# Altium project RA6M1_2.PrjPcb
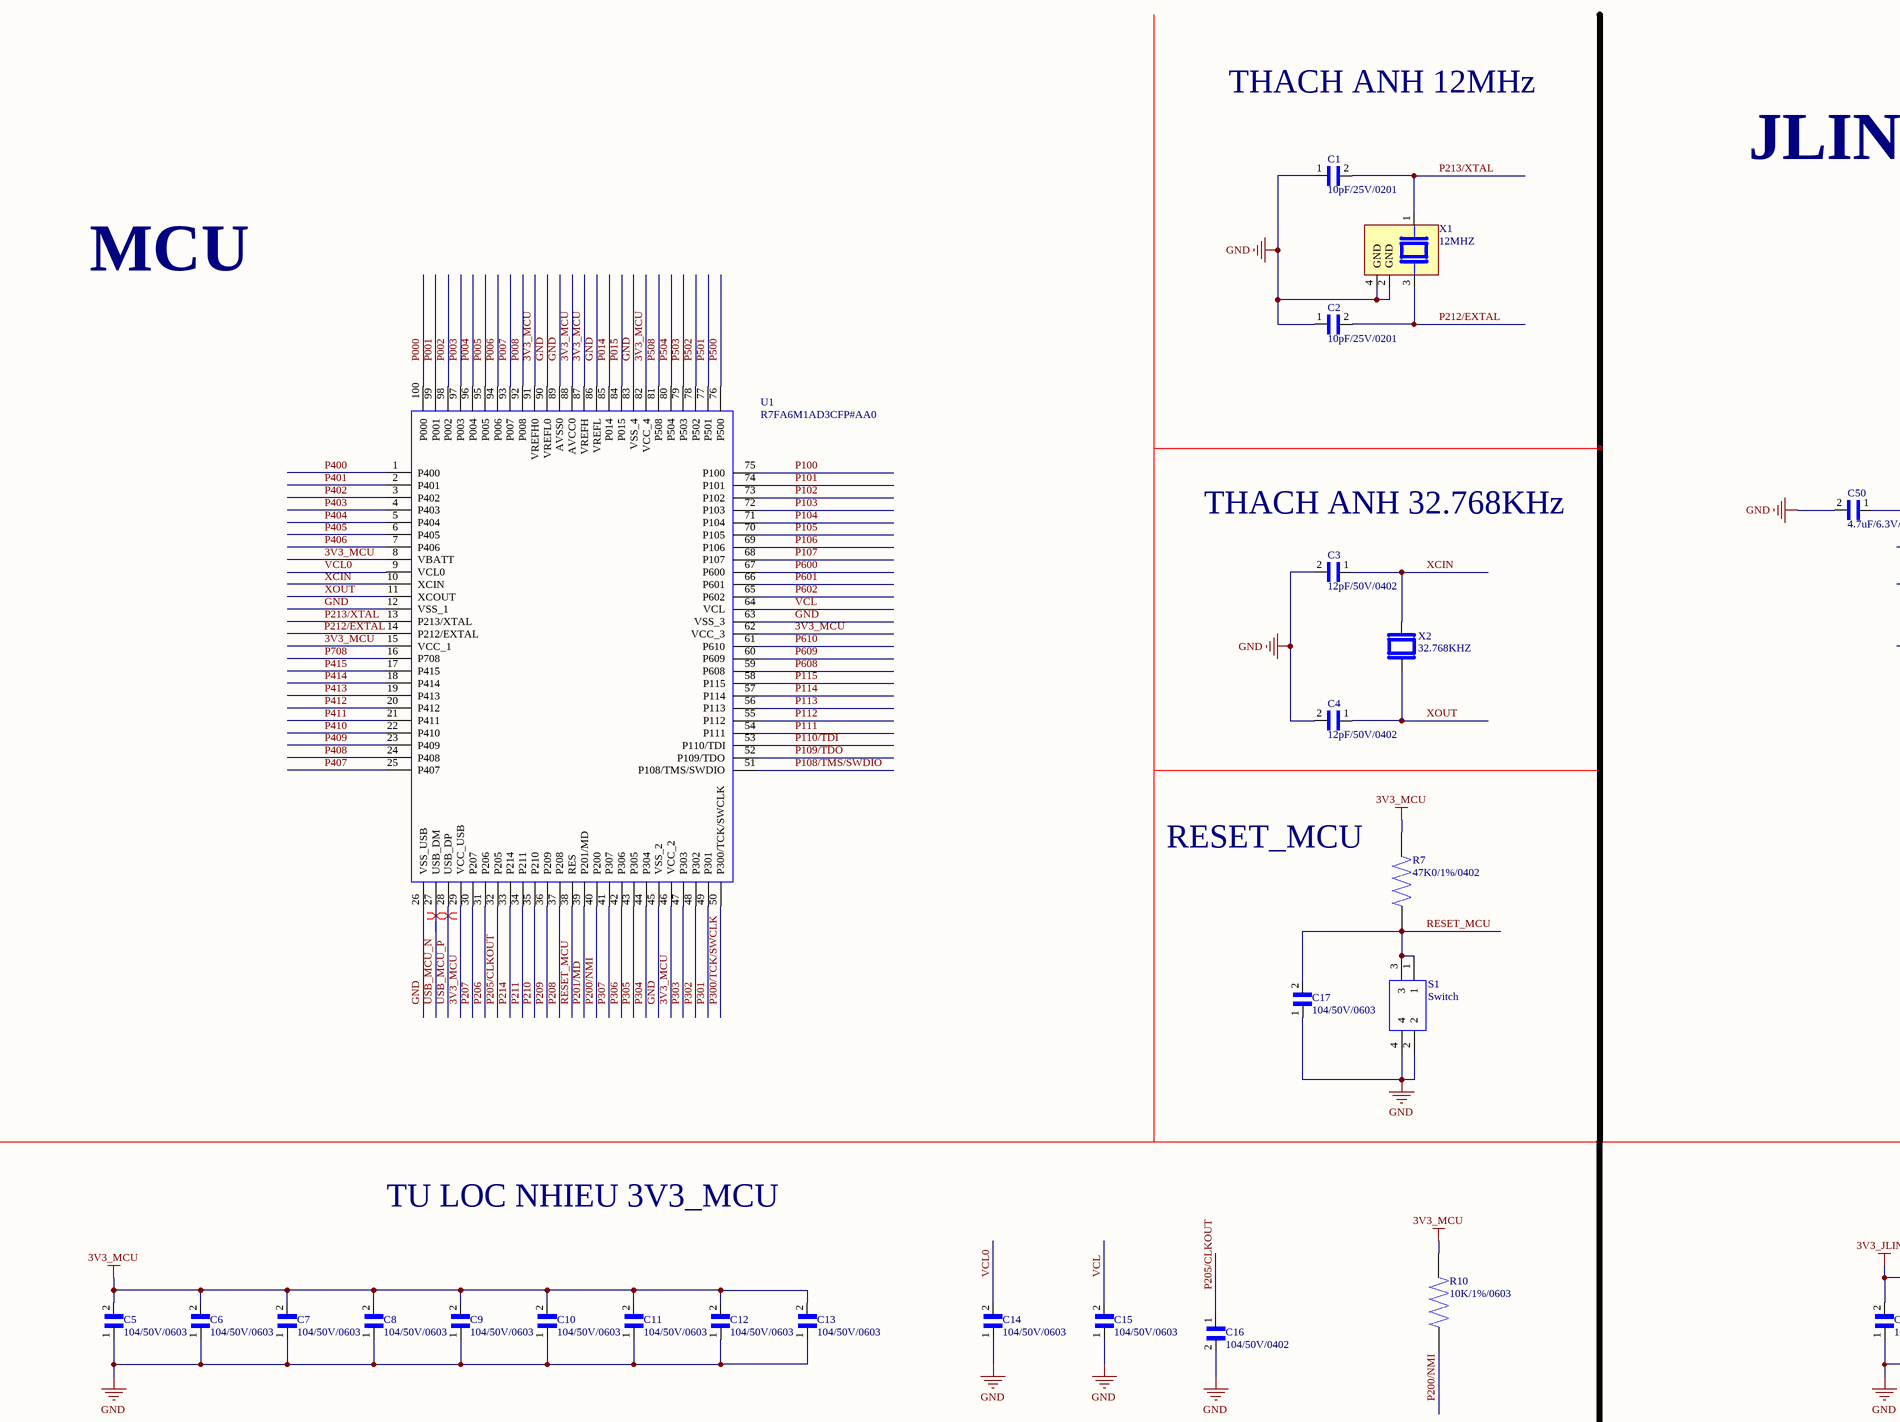
[diagram p0: RA6M1_2.SchDoc, top left]
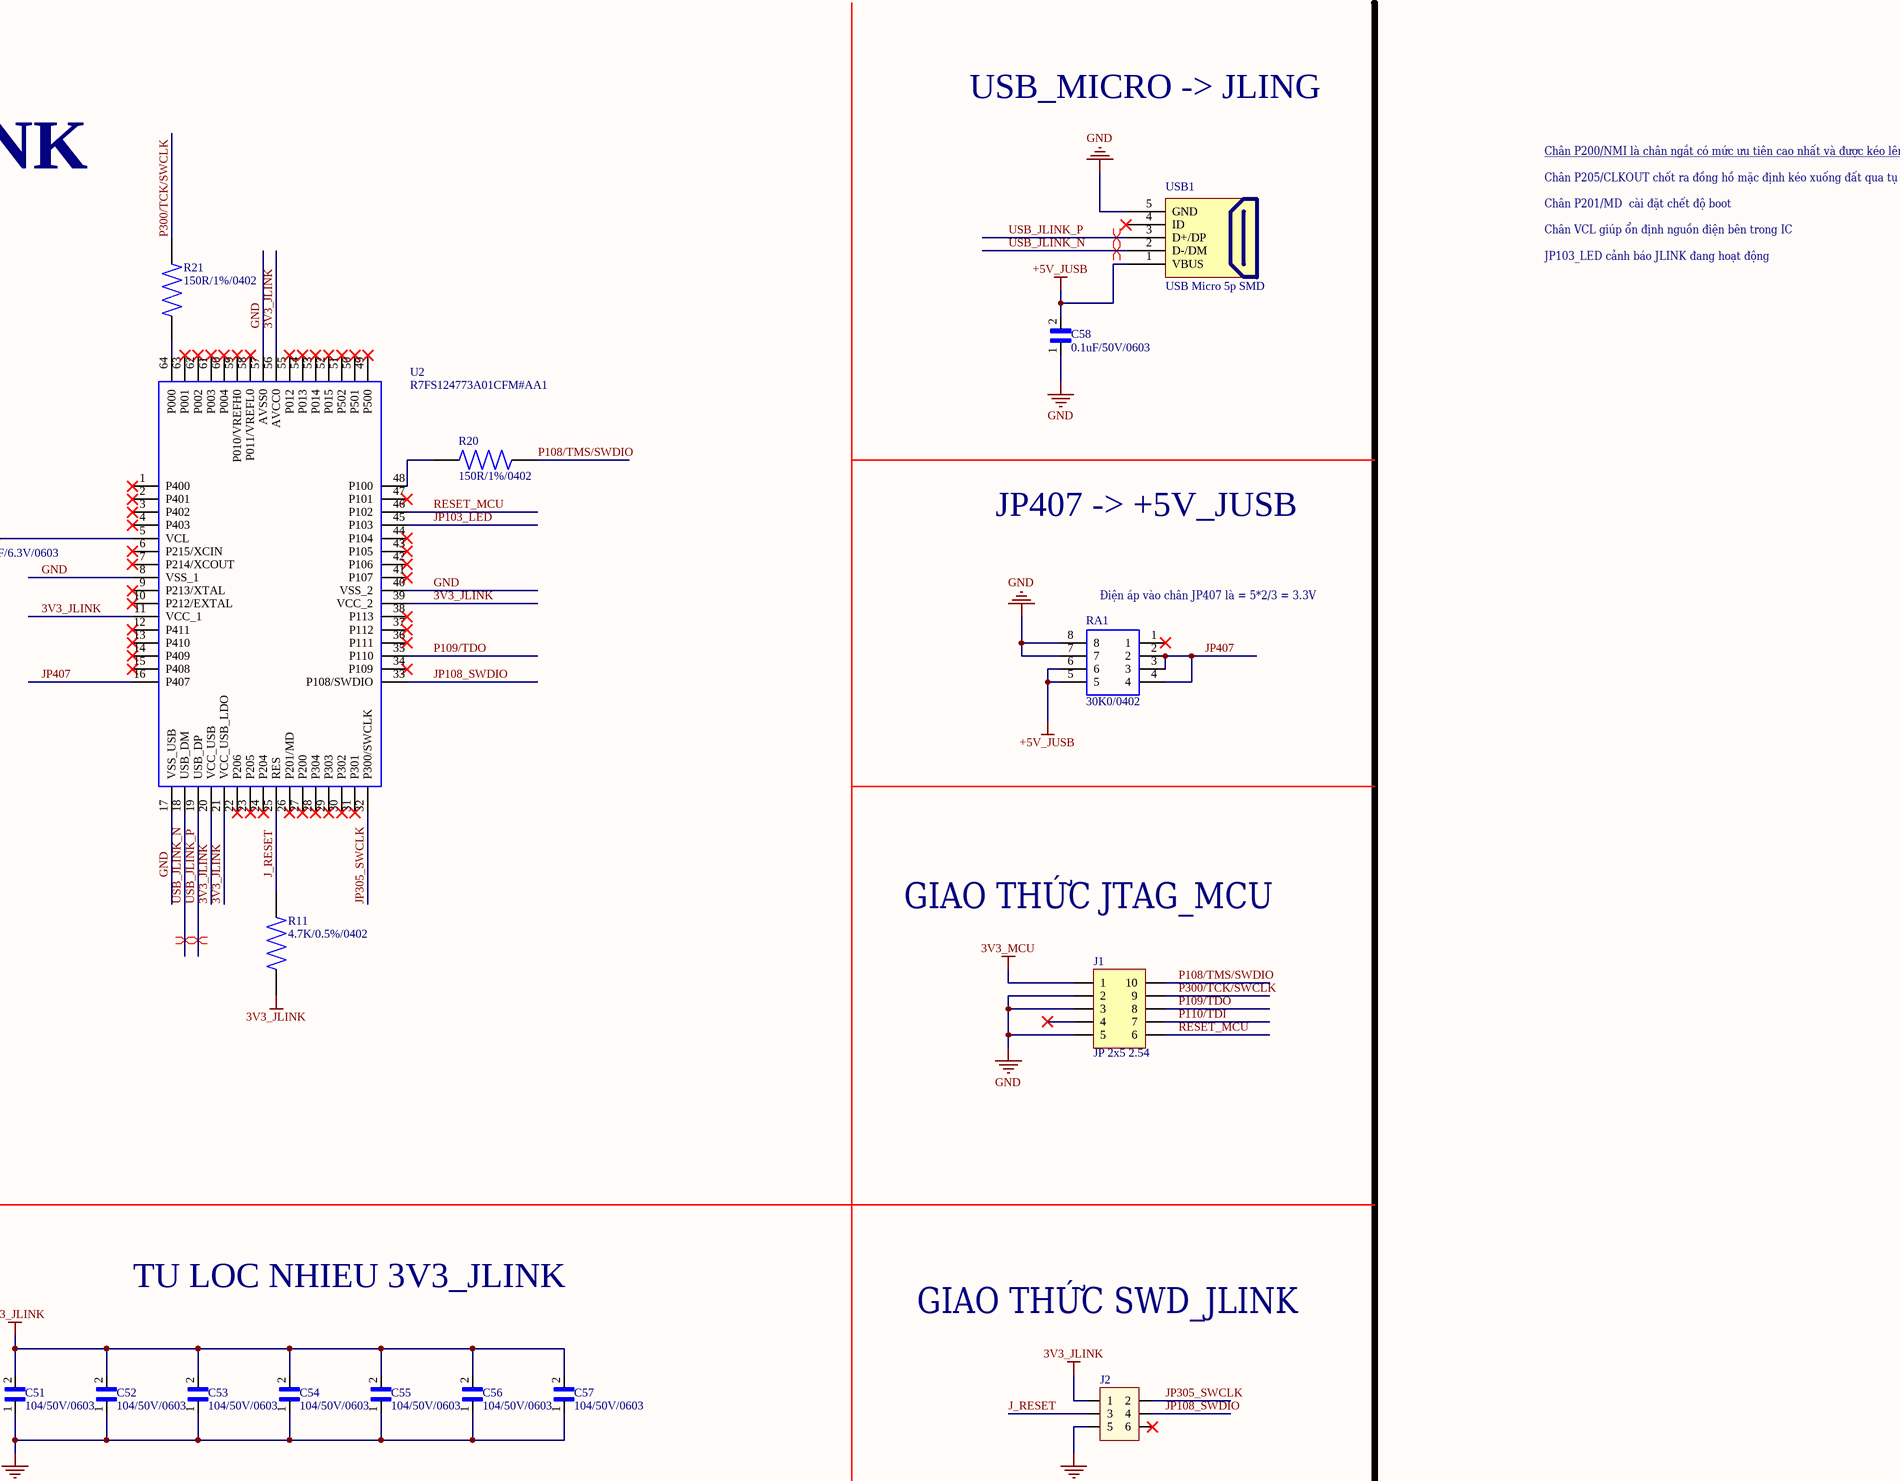
[diagram p1: RA6M1_2.SchDoc, top right]
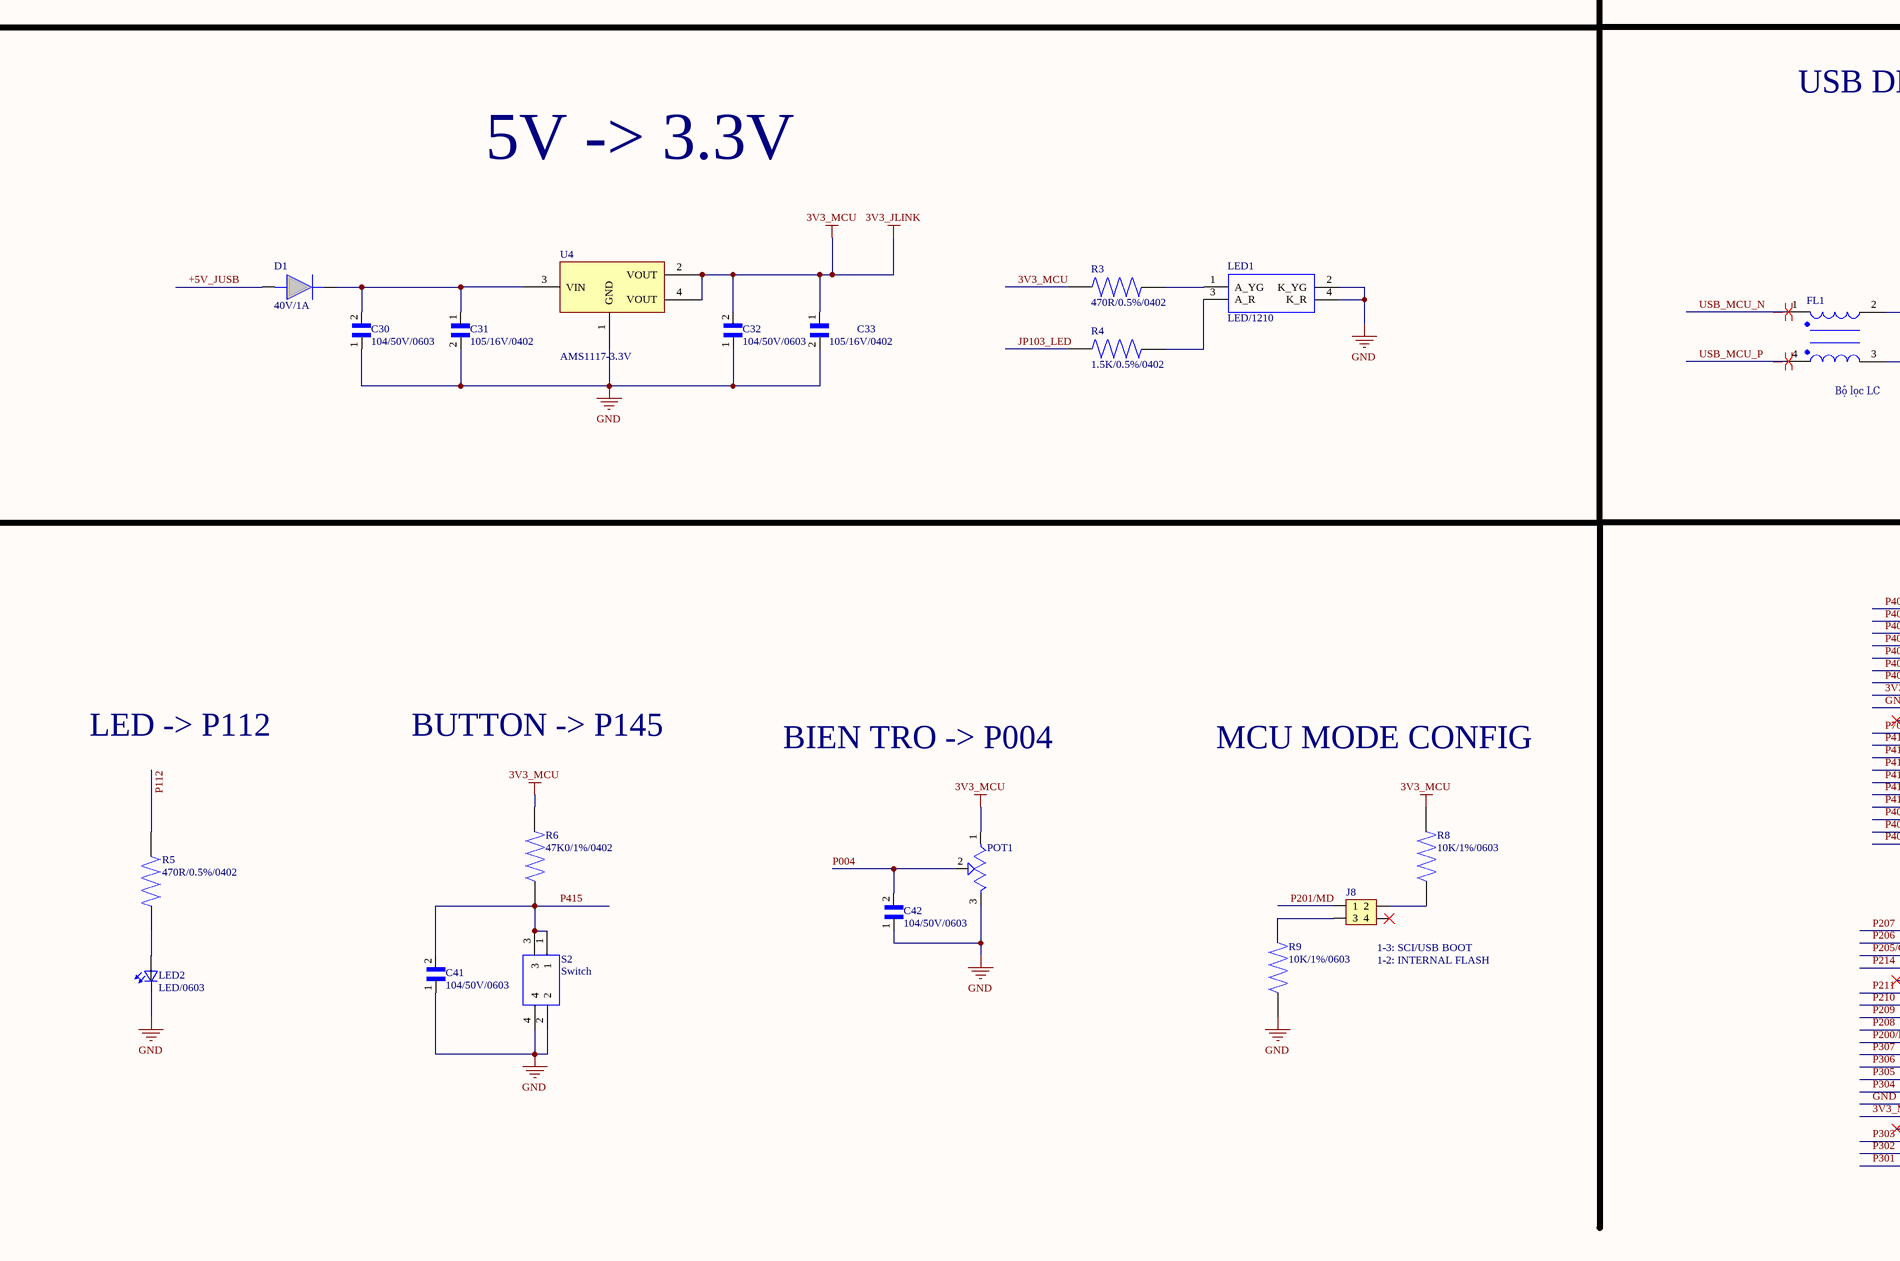
[diagram p2: RA6M1_2.SchDoc, bottom left]
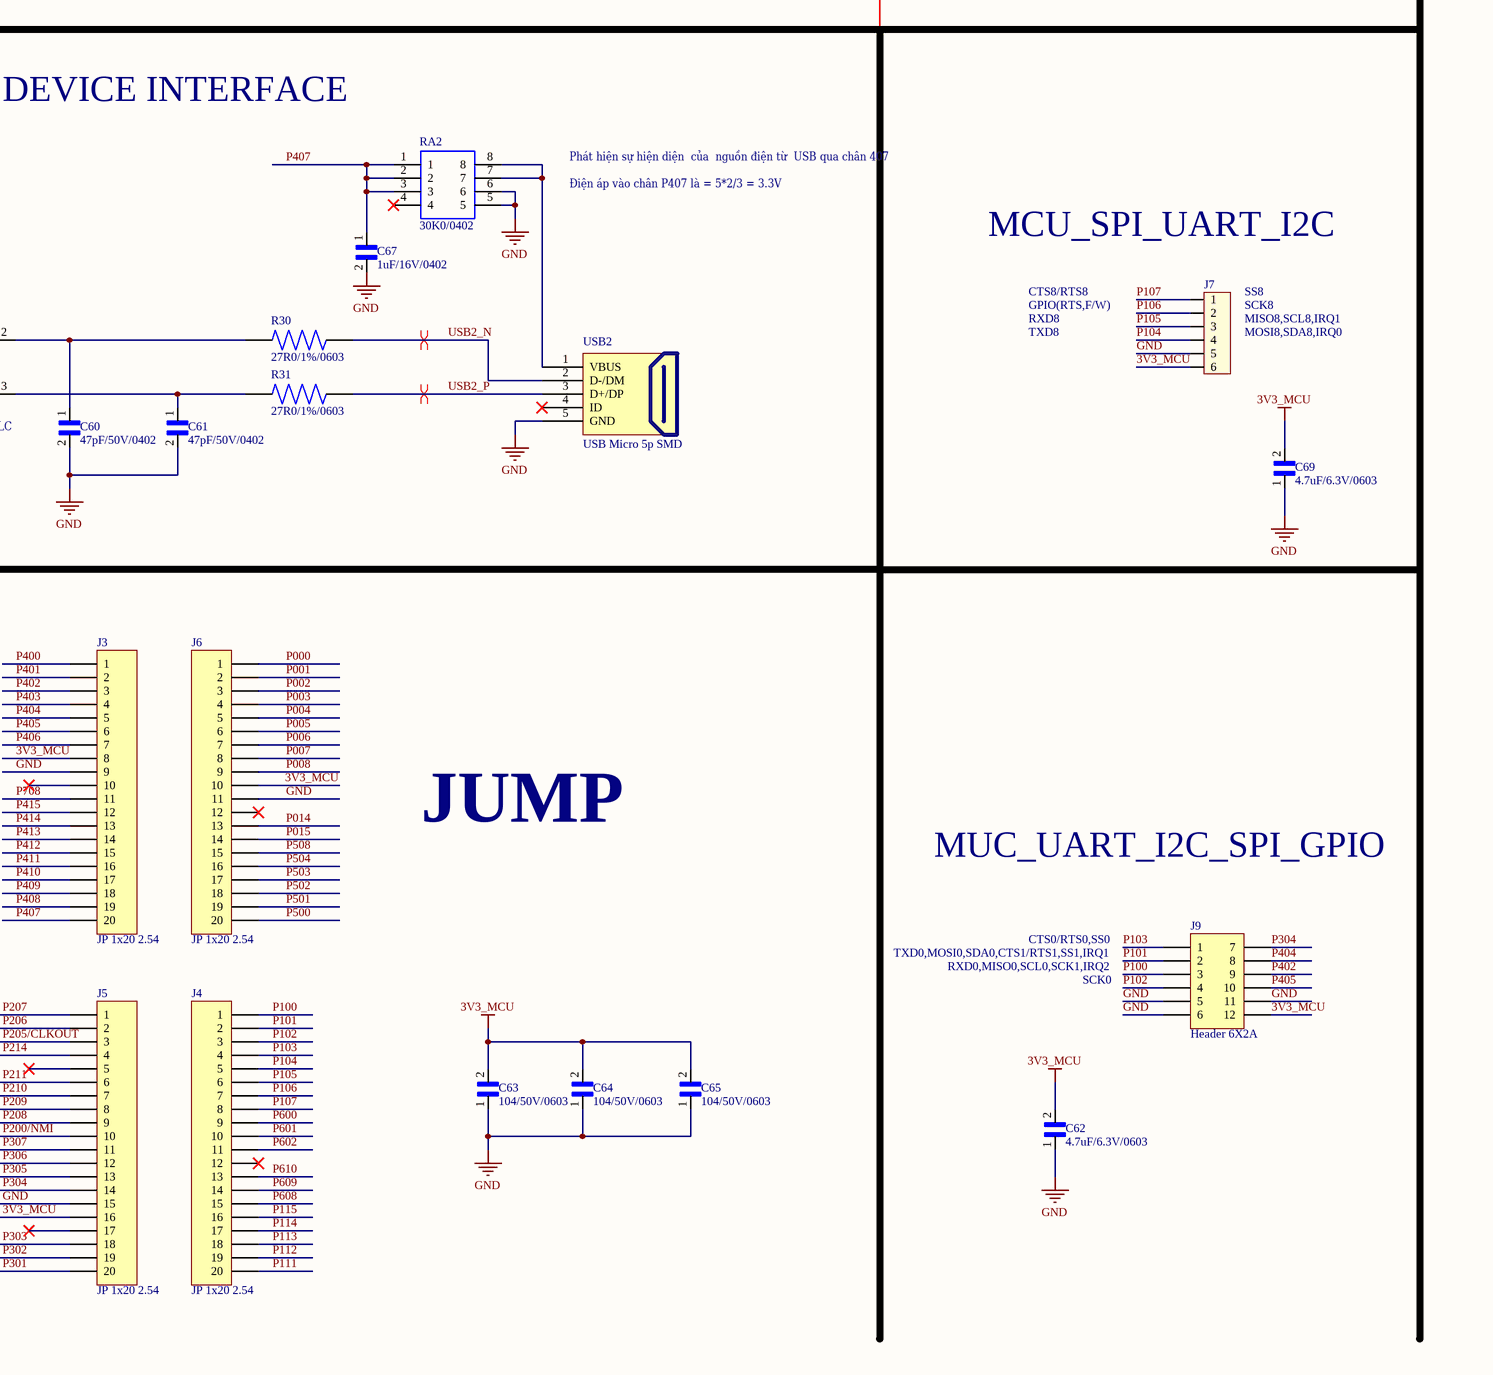
[diagram p3: RA6M1_2.SchDoc, bottom right]
1 sheet, 78 parts. Net scope: global (net labels, ports and power ports of the same name join across sheets).
Board file: RA6M1_2.PcbDoc

## Sheet RA6M1_2.SchDoc
size A1; SheetNumber: 1; SheetTotal: 1

### Parts
C1  10pF/25V/0201  [RESC0603X26N]
C2  10pF/25V/0201  [RESC0603X26N]
C3  12pF/50V/0402  [CAPC1005X55N]
C4  12pF/50V/0402  [CAPC1005X55N]
C5  104/50V/0603  [CAPC1608X90N]
C6  104/50V/0603  [CAPC1608X90N]
C7  104/50V/0603  [CAPC1608X90N]
C8  104/50V/0603  [CAPC1608X90N]
C9  104/50V/0603  [CAPC1608X90N]
C10  104/50V/0603  [CAPC1608X90N]
C11  104/50V/0603  [CAPC1608X90N]
C12  104/50V/0603  [CAPC1608X90N]
C13  104/50V/0603  [CAPC1608X90N]
C14  104/50V/0603  [CAPC1608X90N]
C15  104/50V/0603  [CAPC1608X90N]
C16  104/50V/0402  [CAPC1005X55N]
C17  104/50V/0603  [CAPC1608X90N]
C30  104/50V/0603  [CAPC1608X90N]
C31  105/16V/0402  [CAPC1005X55N]
C32  104/50V/0603  [CAPC1608X90N]
C33  105/16V/0402  [CAPC1005X55N]
C41  104/50V/0603  [CAPC1608X90N]
C42  104/50V/0603  [CAPC1608X90N]
C50  4.7uF/6.3V/0603  [CAPC1608X90N]
C51  104/50V/0603  [CAPC1608X90N]
C52  104/50V/0603  [CAPC1608X90N]
C53  104/50V/0603  [CAPC1608X90N]
C54  104/50V/0603  [CAPC1608X90N]
C55  104/50V/0603  [CAPC1608X90N]
C56  104/50V/0603  [CAPC1608X90N]
C57  104/50V/0603  [CAPC1608X90N]
C58  0.1uF/50V/0603  [CAPC1608X90N]
C60  47pF/50V/0402  [CAPC1005X55N]
C61  47pF/50V/0402  [CAPC1005X55N]
C62  4.7uF/6.3V/0603  [CAPC1608X90N]
C63  104/50V/0603  [CAPC1608X90N]
C64  104/50V/0603  [CAPC1608X90N]
C65  104/50V/0603  [CAPC1608X90N]
C67  1uF/16V/0402  [CAPC1005X55N]
C69  4.7uF/6.3V/0603  [CAPC1608X90N]
D1  40V/1A  [SODFL3616X98N]
FL1  DLP11SN201HL2L  [FIL_DLP11SN201HL2L]  (value not drawn)
J1  JP 2x5 2.54  [JP 2x5 DT]
J2  HEAD 3x2  [HDR2X3]  (value not drawn)
J3  JP 1x20 2.54  [JP 1x20 DT]
J4  JP 1x20 2.54  [JP 1x20 DT]
J5  JP 1x20 2.54  [JP 1x20 DT]
J6  JP 1x20 2.54  [JP 1x20 DT]
J7  JP6  [jam6]  (value not drawn)
J8  JP2x2  [HDR2X2]  (value not drawn)
J9  Header 6X2A  [HDR2X6_CEN]
LED1  LED/1210  [LED_597-7701-507F]
LED2  LED/0603  [0603]
POT1  10K0  [TRIM_3352T-1-103LF]  (value not drawn)
R3  470R/0.5%/0402  [RES_ERA2AED472X]
R4  1.5K/0.5%/0402  [RES_ERA2AED472X]
R5  470R/0.5%/0402  [RES_ERA2AED472X]
R6  47K0/1%/0402  [RES_ERA2AED472X]
R7  47K0/1%/0402  [RES_ERA2AED472X]
R8  10K/1%/0603  [RESC1508X55N]
R9  10K/1%/0603  [RESC1508X55N]
R10  10K/1%/0603  [RESC1508X55N]
R11  4.7K/0.5%/0402  [RES_ERA2AED472X]
R20  150R/1%/0402  [RES_ERA2AED472X]
R21  150R/1%/0402  [RES_ERA2AED472X]
R30  27R0/1%/0603  [RESC1508X55N]
R31  27R0/1%/0603  [RESC1508X55N]
RA1  30K0/0402  [EXB28V510JX]
RA2  30K0/0402  [EXB28V510JX]
S1  Switch  [PTS645(SMT)]
S2  Switch  [PTS645(SMT)]
U1  R7FA6M1AD3CFP#AA0  [QFP50P1600X1600X170-100N]
U2  R7FS124773A01CFM#AA1  [QFP50P1200X1200X170-64N]
U4  AMS1117-3.3V  [SOT223]
USB1  USB Micro 5p SMD  [USB Micro 5p SMD]
USB2  USB Micro 5p SMD  [USB Micro 5p SMD]
X1  12MHZ  [XTAL_ABM8G-12.000MHZ-B4Y-T]
X2  32.768KHZ  [XTAL_ABS07-32.768KHZ-T]

### Nets
3V3_JLINK: C5.2 C6.2 C7.2 C8.2 C9.2 C10.2 C11.2 C12.2 C13.2 C32.2 C33.1 C51.2 C52.2 C53.2 C54.2 C55.2 C56.2 C57.2 C62.2 C63.2 C64.2 C65.2 C69.2 J1.1 J2.1 J3.8 J5.16 J6.10 J7.6 J9.12 POT1.1(CCW) R3.1 R6.2 R7.2 R8.2 R10.2 R11.2 U1.8(VBATT) U1.15(VCC_1) U1.29(VCC_USB) U1.46(VCC_2) U1.62(VCC_3) U1.82(VCC_4) U1.87(VREFH) U1.88(AVCC0) U1.91(VREFH0) U2.11(VCC_1) U2.20(VCC_USB) U2.21(VCC_USB_LDO) U2.39(VCC_2) U2.56(AVCC0) U4.2(VOUT) U4.4(VOUT)  [also labelled 3V3_MCU]
+5V_JUSB: C58.2 D1.2(A) RA1.5 RA1.6 USB1.1(VBUS)
GND: C1.1 C2.1 C3.2 C4.2 C5.1 C6.1 C7.1 C8.1 C9.1 C10.1 C11.1 C12.1 C13.1 C14.1 C15.1 C16.2 C17.1 C30.1 C31.2 C32.1 C33.2 C41.1 C42.1 C50.2 C51.1 C52.1 C53.1 C54.1 C55.1 C56.1 C57.1 C58.1 C60.2 C61.2 C62.1 C63.1 C64.1 C65.1 C67.2 C69.1 J1.2 J1.3 J1.5 J2.5 J3.9 J5.15 J6.11 J7.5 J9.5 J9.6 J9.11 LED1.2(K_YG) LED1.4(K_R) LED2.1(K2) POT1.3(CW) R9.1 RA1.7 RA1.8 RA2.5 RA2.6 S1.2 S1.4 S2.2 S2.4 U1.12(VSS_1) U1.26(VSS_USB) U1.45(VSS_2) U1.63(VSS_3) U1.83(VSS_4) U1.86(VREFL) U1.89(AVSS0) U1.90(VREFL0) U2.8(VSS_1) U2.17(VSS_USB) U2.40(VSS_2) U2.57(AVSS0) U4.1(GND) USB1.5(GND) USB2.5(GND) X1.2(GND) X1.4(GND)
J_RESET: J2.3 R11.1 U2.25(RES)
JP103_LED: R4.1 U2.45(P103)
JP108_SWDIO: J2.4 U2.33(P108/SWDIO)
JP305_SWCLK: J2.2 U2.32(P300/SWCLK)
JP407: RA1.2 RA1.3 RA1.4 U2.16(P407)
P000: J6.1 U1.100(P000)
P001: J6.2 U1.99(P001)
P002: J6.3 U1.98(P002)
P003: J6.4 U1.97(P003)
P004: C42.2 J6.5 POT1.2(WIPER) U1.96(P004)
P005: J6.6 U1.95(P005)
P006: J6.7 U1.94(P006)
P007: J6.8 U1.93(P007)
P008: J6.9 U1.92(P008)
P014: J6.13 U1.85(P014)
P015: J6.14 U1.84(P015)
P100: J4.1 J9.3 U1.75(P100)
P101: J4.2 J9.2 U1.74(P101)
P102: J4.3 J9.4 U1.73(P102)
P103: J4.4 J9.1 U1.72(P103)
P104: J4.5 J7.4 U1.71(P104)
P105: J4.6 J7.3 U1.70(P105)
P106: J4.7 J7.2 U1.69(P106)
P107: J4.8 J7.1 U1.68(P107)
P108/TMS/SWDIO: J1.10 R20.2 U1.51(P108/TMS/SWDIO)
P109/TDO: J1.8 U1.52(P109/TDO) U2.35(P110)
P110/TDI: J1.7 U1.53(P110/TDI)
P111: J4.20 U1.54(P111)
P112: J4.19 R5.1 U1.55(P112)
P113: J4.18 U1.56(P113)
P114: J4.17 U1.57(P114)
P115: J4.16 U1.58(P115)
P200/NMI: J5.10 R10.1 U1.40(P200)
P201/MD: J8.1 U1.39(P201/MD)
P205/CLKOUT: C16.1 J5.3 U1.32(P205)
P206: J5.2 U1.31(P206)
P207: J5.1 U1.30(P207)
P208: J5.9 U1.37(P208)
P209: J5.8 U1.36(P209)
P210: J5.7 U1.35(P210)
P211: J5.6 U1.34(P211)
P212/EXTAL: C2.2 U1.14(P212/EXTAL) X1.3
P213/XTAL: C1.2 U1.13(P213/XTAL) X1.1
P214: J5.4 U1.33(P214)
P300/TCK/SWCLK: J1.9 R21.1 U1.50(P300/TCK/SWCLK)
P301: J5.20 U1.49(P301)
P302: J5.19 U1.48(P302)
P303: J5.18 U1.47(P303)
P304: J5.14 J9.7 U1.44(P304)
P305: J5.13 U1.43(P305)
P306: J5.12 U1.42(P306)
P307: J5.11 U1.41(P307)
P400: J3.1 U1.1(P400)
P401: J3.2 U1.2(P401)
P402: J3.3 J9.9 U1.3(P402)
P403: J3.4 U1.4(P403)
P404: J3.5 J9.8 U1.5(P404)
P405: J3.6 J9.10 U1.6(P405)
P406: J3.7 U1.7(P406)
P407: C67.1 J3.20 RA2.1 RA2.2 RA2.3 U1.25(P407)
P408: J3.19 U1.24(P408)
P409: J3.18 U1.23(P409)
P410: J3.17 U1.22(P410)
P411: J3.16 U1.21(P411)
P412: J3.15 U1.20(P412)
P413: J3.14 U1.19(P413)
P414: J3.13 U1.18(P414)
P415: C41.2 J3.12 R6.1 S2.1 S2.3 U1.17(P415)
P500: J6.20 U1.76(P500)
P501: J6.19 U1.77(P501)
P502: J6.18 U1.78(P502)
P503: J6.17 U1.79(P503)
P504: J6.16 U1.80(P504)
P508: J6.15 U1.81(P508)
P600: J4.9 U1.67(P600)
P601: J4.10 U1.66(P601)
P602: J4.11 U1.65(P602)
P608: J4.15 U1.59(P608)
P609: J4.14 U1.60(P609)
P610: J4.13 U1.61(P610)
P708: J3.11 U1.16(P708)
RESET_MCU: C17.2 J1.6 R7.1 S1.1 S1.3 U1.38(RES) U2.46(P102)
USB2_N: R30.2 USB2.2(D-/DM)
USB2_P: R31.2 USB2.3(D+/DP)
USB_JLINK_N: U2.18(USB_DM) USB1.2(D-/DM)
USB_JLINK_P: U2.19(USB_DP) USB1.3(D+/DP)
USB_MCU_N: FL1.1 U1.27(USB_DM)
USB_MCU_P: FL1.4 U1.28(USB_DP)
VCL: C15.2 U1.64(VCL)
VCL0: C14.2 U1.9(VCL0)
XCIN: C3.1 U1.10(XCIN) X2.1
XOUT: C4.1 U1.11(XCOUT) X2.2
NetC30_2: C30.2 C31.1 D1.1(K) U4.3(VIN)
NetC50_1: C50.1 U2.5(VCL)
NetC60_1: C60.1 FL1.2 R30.1
NetC61_1: C61.1 FL1.3 R31.1
NetJ8_2: J8.2 R8.1
NetJ8_3: J8.3 R9.2
NetLED1_1: LED1.1(A_YG) R3.2
NetLED1_3: LED1.3(A_R) R4.2
NetLED2_2: LED2.2(A2) R5.2
NetR20_1: R20.1 U2.48(P100)
NetR21_2: R21.2 U2.64(P000)
NetRA2_7: RA2.7 RA2.8 USB2.1(VBUS)

Not connected (* = marked no-connect by the designer): J1 4*; J2 6*; J3 10*; J4 12*; J5 5* 17*; J6 12*; J8 4*; RA1 1*; RA2 4*; U2 1(P400)* 2(P401)* 3(P402)* 4(P403)* 6(P215/XCIN)* 7(P214/XCOUT)* 9(P213/XTAL)* 10(P212/EXTAL)* 12(P411)* 13(P410)* 14(P409)* 15(P408)* 22(P206)* 23(P205)* 24(P204)* 26(P201/MD)* 27(P200)* 28(P304)* 29(P303)* 30(P302)* 31(P301)* 34(P109)* 36(P111)* 37(P112)* 38(P113)* 41(P107)* 42(P106)* 43(P105)* 44(P104)* 47(P101)* 49(P500)* 50(P501)* 51(P502)* 52(P015)* 53(P014)* 54(P013)* 55(P012)* 58(P011/VREFL0)* 59(P010/VREFH0)* 60(P004)* 61(P003)* 62(P002)* 63(P001)*; USB1 4(ID)*; USB2 4(ID)*

### Layout directives
differential pair: USB2_N, USB2_P, USB_JLINK_N, USB_JLINK_P, USB_MCU_N, USB_MCU_P

### Notes on the sheet
- THACH ANH 12MHz
- USB_MICRO -> JLING
- Chân P200/NMI là chân ngắt có mức ưu tiên cao nhất và được kéo lên mức 1. <https://filegi.com/tech-term/non-maskable-interrupt-nmi-3773/>
- JLINK
- Chân P205/CLKOUT chốt ra đồng hồ mặc định kéo xuống đất qua tụ
- Chân P201/MD  cài đặt chết độ boot
- Chân VCL giúp ổn định nguồn điện bên trong IC
- JP103_LED cảnh báo JLINK đang hoạt động
- MCU
- THACH ANH 32.768KHz
- JP407 -> +5V_JUSB
- (near RA1) Điện áp vào chân JP407 là = 5*2/3 = 3.3V
- RESET_MCU
- GIAO THỨC JTAG_MCU
- TU LOC NHIEU 3V3_MCU
- TU LOC NHIEU 3V3_JLINK
- GIAO THỨC SWD_JLINK
- USB DEVICE INTERFACE
- 5V -> 3.3V
- Phát hiện sự hiện diện  của  nguồn điện từ  USB qua chân 407
- Điện áp vào chân P407 là = 5*2/3 = 3.3V
- MCU_SPI_UART_I2C
- CTS8/RTS8
- RXD8
- GPIO(RTS,F/W)
- (near J7) SS8
- (near J7) MISO8,SCL8,IRQ1
- (near J7) SCK8
- TXD8
- (near J7) MOSI8,SDA8,IRQ0
- (near FL1) Bộ lọc LC
- LED -> P112
- BUTTON -> P145
- BIEN TRO -> P004
- MCU MODE CONFIG
- JUMP
- MUC_UART_I2C_SPI_GPIO
- TXD0,MOSI0,SDA0,CTS1/RTS1,SS1,IRQ1
- RXD0,MISO0,SCL0,SCK1,IRQ2
- CTS0/RTS0,SS0
- SCK0
- (near J8) 1-3: SCI/USB BOOT
- (near J8) 1-2: INTERNAL FLASH

### Library data of the parts
C1 C2 = RESC0603X26N: TU0201; MP: CL10B104KB8NNNC; MF: Samsung Electro-Mechanics; Price: None; SnapEDA_Link: https://www.snapeda.com/parts/CL10B104KB8NNNC/Samsung%20Electro-Mechanics/view-part/3598309/?ref=snap; Availability: Unavailable; Package: 0603 Samsung; Value: *
C3 C4 C16 C31 C33 C60 C61 C67 = CL05A105KO5NNNC: 1ÂµF Â±10% 16V Ceramic Capacitor X5R 0402 (1005 Metric); MF: Samsung Electro-Mechanics; Purchase-URL: https://pricing.snapeda.com/search/part/CL05A105KO5NNNC/?ref=eda; SnapEDA_Link: https://www.snapeda.com/parts/CL05A105KO5NNNC/Samsung%20Electro-Mechanics/view-part/3598151/?ref=snap; Availability: Good; Price: None; MP: CL05A105KO5NNNC; Check_prices: https://www.snapeda.com/parts/CL05A105KO5NNNC/Samsung%20Electro-Mechanics/view-part/3598151/?ref=eda; Package: 0402 Samsung; Value: *
C5-C15 C17 C30 C32 C41 C42 C50-C58 C62-C65 C69 = CL10B104KB8NNNC: 0.1ÂµF Â±10% 50V Ceramic Capacitor X7R 0603 _1608 Metric_; MF: Samsung Electro-Mechanics; Price: None; MP: CL10B104KB8NNNC; SnapEDA_Link: https://www.snapeda.com/parts/CL10B104KB8NNNC/Samsung%20Electro-Mechanics/view-part/3598309/?ref=snap; Availability: Unavailable; Package: 0603 Samsung; Value: *
D1 = MBR140SFT1G: Diode Schottky 40V 1A SOD-123FL ON Semiconductor MBR140SFT1G Schottky Diode, 1A, 40V, 2-Pin SOD-123FL; Manufacturer_Name: onsemi; Geometry.Height: 0.98mm; Manufacturer_Part_Number: MBR140SFT1G; Mouser Part Number: 863-MBR140SFT1G; Mouser Price/Stock: https://www.mouser.co.uk/ProductDetail/onsemi/MBR140SFT1G?qs=3JMERSakebrc0eIUjXPasA%3D%3D; Arrow Part Number: MBR140SFT1G; Arrow Price/Stock: https://www.arrow.com/en/products/mbr140sft1g/on-semiconductor?region=nac; Mouser Testing Part Number: *; Mouser Testing Price/Stock: *; Datasheet Link: http://www.onsemi.com/pub/Collateral/MBR140SFT1-D.PDF
FL1 = DLP11SN201HL2L: 2 Line Common Mode Choke Surface Mount 200 Ohms @ 100MHz 110mA DCR 3.88Ohm; MF: Murata; DigiKey-Purchase-URL: https://snapeda.com/shop?store=DigiKey&id=4300877; SnapEDA_Link: https://www.snapeda.com/parts/DLP11SN201HL2L/Murata/view-part/4300877/?ref=snap; MP: DLP11SN201HL2L; Availability: Unavailable; Price: None; Value: *; Package: 1210 Murata
J1 = JP 2x5 2.54 Duc Thang: Cắm; Ten_Linh_Kien: Jump Đôi Đực 2.54MM 2x40P Thẳng 11MM; Don_Vi: Con; Ma_Hang: MH002686; Ghi_Chu: *; Kieu_Chan: *; Chung_Loai: Cắm
J2 = JP3x2: Connector 3x2; Value: Connector 3x2
J3-J6 = JP 1x20 2.54 Duc Thang: Cắm; Ten_Linh_Kien: Jump Đơn Đực 2.54MM 1x40P Thẳng 11MM; Don_Vi: Con; Ma_Hang: MH000903; Ghi_Chu: *; Kieu_Chan: *; Chung_Loai: Cắm
J7 = jam 6: Value: Connector 6
J9 = Header 6X2A: Header, 6-Pin, Dual row; LatestRevisionDate: 17-Jul-2002; LatestRevisionNote: Re-released for DXP Platform.; Publisher: Altium Limited
LED1 = 598-8610-207F: Standard LEDs - SMD Red/Green WC 80/50mcd 645/570nm; Manufacturer_Name: Dialight; Geometry.Height: 0.8mm; Manufacturer_Part_Number: 598-8610-207F; Mouser Part Number: 645-598-8610-207F; Mouser Price/Stock: https://www.mouser.co.uk/ProductDetail/Dialight/598-8610-207F?qs=7JStj%2FjQ2SFuCjosqwklHQ%3D%3D; Arrow Part Number: 598-8610-207F; Arrow Price/Stock: https://www.arrow.com/en/products/598-8610-207f/dialight?region=nac; Mouser Testing Part Number: *; Mouser Testing Price/Stock: *; Datasheet Link: https://media.digikey.com/pdf/Data%20Sheets/Dialight%20PDFs/598%20Series%201210%20Pkg%20Bi-Color.pdf
LED2 = LTST-C191KRKT: http://octopart.com/ltst-c190krkt-lite-on-549893; Package: None; MP: LTST-C191KRKT; Value: *; Availability: Unavailable; Price: None
POT1 = 3352T-1-103LF: 10 kOhms 0.5W, 1/2W Through Hole Thumbwheel Potentiometer Top Adjustment; MF: Bourns; Package: 3352T-3 Bourns; MP: 3352T-1-103LF; Availability: In Stock; SnapEDA_Link: https://www.snapeda.com/parts/3352T-1-103LF/Bourns/view-part/?ref=snap; Price: None; Check_prices: https://www.snapeda.com/parts/3352T-1-103LF/Bourns/view-part/?ref=eda; Value: *; Purchase-URL: https://pricing.snapeda.com/search/part/3352T-1-103LF/?ref=eda
R3-R7 R11 R20 R21 = ERA2AED472X: Res Thin Film 0402 4.7K Ohm 0.5% 0.063W(1/16W) 25ppm/C Molded SMD Automotive Punched T/R; MF: Panasonic Electronic; MP: ERA-2AED472X; Package: 1005-2 Panasonic; Purchase-URL: https://pricing.snapeda.com/search/part/ERA-2AED472X/?ref=eda; Value: *; Check_prices: https://www.snapeda.com/parts/ERA-2AED472X/Panasonic+Electronic+Components/view-part/?ref=eda; Price: None; Availability: In Stock; SnapEDA_Link: https://www.snapeda.com/parts/ERA-2AED472X/Panasonic+Electronic+Components/view-part/?ref=snap
R8-R10 R30 R31 = RMCF0603JT27R0: Package: None; Price: None; Value: *; MP: RMCF0603JT27R0; Availability: Unavailable
RA1 RA2 = EXB28V303JX: Resistor Networks & Arrays Resistor ArrayChip 0804 4 elements; Manufacturer_Name: Panasonic; Geometry.Height: 0mm; Manufacturer_Part_Number: EXB28V303JX; Mouser Part Number: *; Mouser Price/Stock: *; Arrow Part Number: *; Arrow Price/Stock: *; Mouser Testing Part Number: *; Mouser Testing Price/Stock: *; Datasheet Link: https://industrial.panasonic.com/cdbs/www-data/pdf/AOC0000/AOC0000C14.pdf
S1 S2 = PTS645SM43SMTR92LFS: C & K COMPONENTS - PTS645SM43SMTR92LFS - SWITCH, SPST, 0.05A, 12VDC, SMD, 4.3MM; Manufacturer_Name: C & K COMPONENTS; Manufacturer_Part_Number: PTS645SM43SMTR92LFS; Mouser Part Number: 611-PTS645SM43SMTR92; Mouser Price/Stock: https://www.mouser.co.uk/ProductDetail/CK/PTS645SM43SMTR92LFS?qs=FESYatJ8odKPktxv6ncfWg%3D%3D; Arrow Part Number: PTS645SM43SMTR92LFS; Arrow Price/Stock: https://www.arrow.com/en/products/pts645sm43smtr92lfs/ck; Mouser Testing Part Number: *; Mouser Testing Price/Stock: *; Datasheet Link: http://www.farnell.com/datasheets/1914518.pdf
U1 = R7FA6M1AD3CFP#AA0: ARM Cortex-M4 RA6M1 Microcontroller IC 32-Bit 120MHz 512KB (512K x 8) FLASH 100-LFQFP (14x14); Manufacturer_Name: Renesas Electronics; Geometry.Height: 1.7mm; Manufacturer_Part_Number: R7FA6M1AD3CFP#AA0; Mouser Part Number: 968-7FA6M1AD3CFP#AA0; Mouser Price/Stock: https://www.mouser.co.uk/ProductDetail/Renesas-Electronics/R7FA6M1AD3CFPAA0?qs=d0WKAl%252BL4KaRUVVllxsS6w%3D%3D; Arrow Part Number: *; Arrow Price/Stock: *; Mouser Testing Part Number: *; Mouser Testing Price/Stock: *; Datasheet Link: https://www.renesas.com/in/en/document/dst/renesas-ra6m1-group-datasheet
U2 = R7FS124773A01CFM#AA1: S124; Manufacturer_Name: Renesas Electronics; Geometry.Height: 1.7mm; Manufacturer_Part_Number: R7FS124773A01CFM#AA1; Mouser Part Number: 968-124773A01CFM#AA1; Mouser Price/Stock: https://www.mouser.co.uk/ProductDetail/Renesas-Electronics/R7FS124773A01CFMAA1?qs=wUXugUrL1qwGPed2E2%2FoEA%3D%3D; Arrow Part Number: *; Arrow Price/Stock: *; Mouser Testing Part Number: *; Mouser Testing Price/Stock: *; Datasheet Link: https://www.renesas.com/en-us/doc/products/renesas-synergy/doc/r01ds0264eu0130-synergy-s124.pdf
U4 = AMS1117 SMD: Dán; Value: AMS1117-3.3V SOT223; Don_Vi: Con; Ma_Hang: MH000596; Ghi_Chu: *; Kieu_Chan: *; Chung_Loai: Dán
USB1 USB2 = USB Micro 5p SMD: USB Type B; Ten: MicroUSB MK5P SMD; Ma_Hang: MH001020
X1 = ABM8G-12.000MHZ-B4Y-T: 12 MHz Â±30ppm Crystal 10pF 120 Ohms 4-SMD, No Lead; MF: Abracon; Purchase-URL: https://pricing.snapeda.com/search/part/ABM8G-12.000MHZ-B4Y-T/?ref=eda; SnapEDA_Link: https://www.snapeda.com/parts/ABM8G-12.000MHZ-B4Y-T/Abracon+LLC/view-part/?ref=snap; Price: None; Check_prices: https://www.snapeda.com/parts/ABM8G-12.000MHZ-B4Y-T/Abracon+LLC/view-part/?ref=eda; MP: ABM8G-12.000MHZ-B4Y-T; Value: *; Availability: In Stock; Package: SMD-4 Abracon
X2 = ABS07-32.768KHZ-T: 32.768 kHz Â±20ppm Crystal 12.5pF 70 kOhms 2-SMD, No Lead; MF: Abracon; Availability: In Stock; SnapEDA_Link: https://www.snapeda.com/parts/ABS07-32.768KHZ-T/Abracon+LLC/view-part/?ref=snap; MP: ABS07-32.768KHZ-T; Price: None; Value: *; Check_prices: https://www.snapeda.com/parts/ABS07-32.768KHZ-T/Abracon+LLC/view-part/?ref=eda; Purchase-URL: https://pricing.snapeda.com/search/part/ABS07-32.768KHZ-T/?ref=eda; Package: SMD-2 Abracon LLC